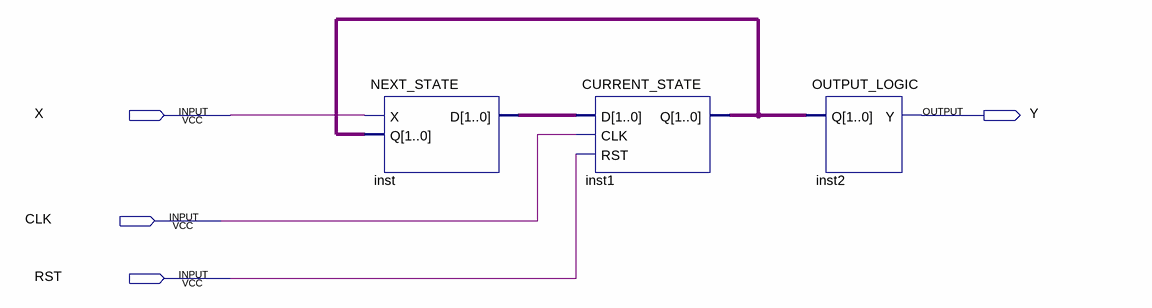
[diagram p0: schematic sheet]
// Quartus schematic BAI1_MOORE.bdf as structural Verilog: 3 symbols, 4 pins
module BAI1_MOORE (
  input  X,
  input  CLK,
  input  RST,
  output Y
);

  wire [1:0] inst1_q, inst_d;

  NEXT_STATE inst (.X(X), .Q(inst1_q), .D(inst_d));
  CURRENT_STATE inst1 (.D(inst_d), .CLK(CLK), .RST(RST), .Q(inst1_q));
  OUTPUT_LOGIC inst2 (.Q(inst1_q), .Y(Y));
endmodule
